# Altium schematic sheet H204_R_MCUs.SchDoc: H204 - MCUs
size A2; SheetNumber: 1; SheetTotal: 3; PageSetup: Record=PageOptions|CenterHorizontal=True|CenterVertical=True|PrintScale=0.63|XCorrection=1.00|YCorrection=1.00|PrintKind=0|BorderSize=5000000|LeftOffset=0|BottomOffset=0|Orientation=2|PaperLength=2794|PaperWidth=4318|Scale=100|PaperSource=7|PrintQuality=600|MediaType=1|DitherType=10|PaperKind=Legal (8 ½ x 14 in)|PrintScaleMode=1
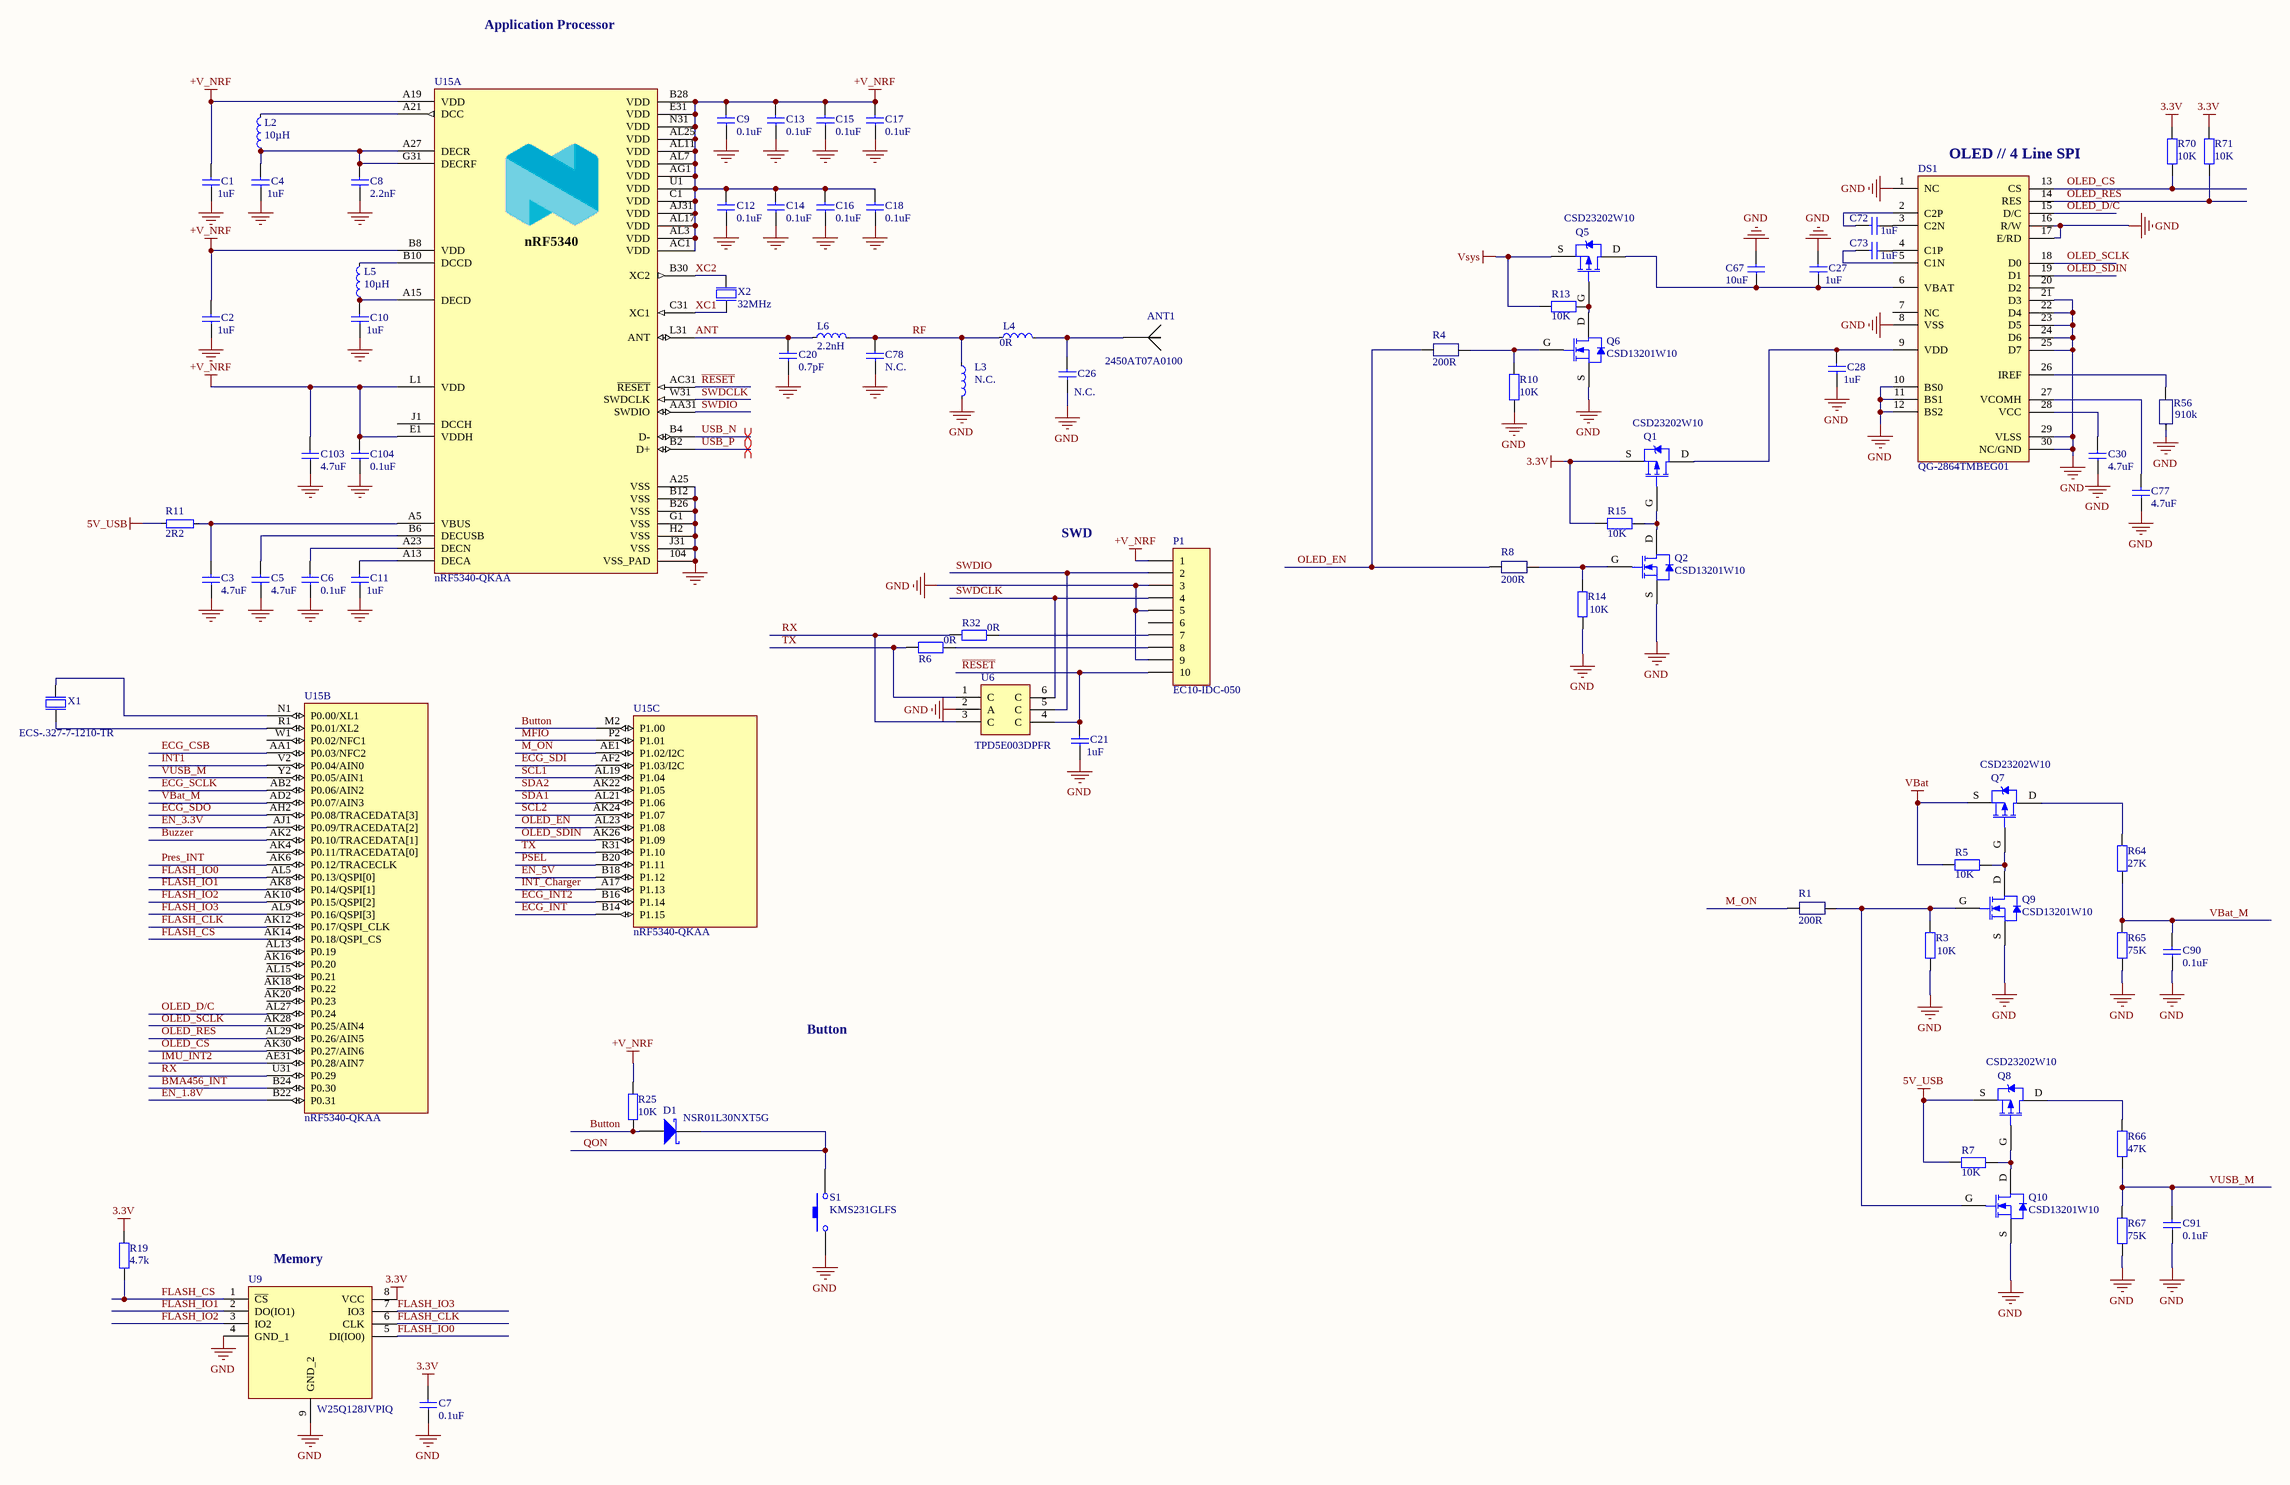
[diagram p0: H204_R_MCUs.SchDoc]

## Parts
ANT1  2450AT07A0100  [2450AT07A0100]
C1  1uF  [CAPC0603X33N]
C2  1uF  [CAPC0603X33N]
C3  4.7uF  [CAPC1005X55N]
C4  1uF  [CAPC0603X33N]
C5  4.7uF  [CAPC1005X55N]
C6  0.1uF  [CAPC0603X33N]
C7  0.1uF  [CAPC0603X33N]
C8  2.2nF  [CAPC0603X33N]
C9  0.1uF  [CAPC0603X33N]
C10  1uF  [CAPC0603X33N]
C11  1uF  [CAPC0603X33N]
C12  0.1uF  [CAPC0603X33N]
C13  0.1uF  [CAPC0603X33N]
C14  0.1uF  [CAPC0603X33N]
C15  0.1uF  [CAPC0603X33N]
C16  0.1uF  [CAPC0603X33N]
C17  0.1uF  [CAPC0603X33N]
C18  0.1uF  [CAPC0603X33N]
C20  0.7pF  [CAPC0603X33N]
C21  1uF  [CAPC0603X33N]
C26  N.C.  [CAPC0603X33N]
C27  1uF  [CAPC0603X33N]
C28  1uF  [CAPC0603X33N]
C30  4.7uF  [CAPC1005X55N]
C67  10uF  [CAPC1005X55N]
C72  1uF  [CAPC0603X33N]
C73  1uF  [CAPC0603X33N]
C77  4.7uF  [CAPC1005X55N]
C78  N.C.  [CAPC0603X33N]
C90  0.1uF  [CAPC0603X33N]
C91  0.1uF  [CAPC0603X33N]
C103  4.7uF  [CAPC1005X55N]
C104  0.1uF  [CAPC0603X33N]
D1  NSR01L30NXT5G  [NSR01L30NXT5G]
DS1  QG-2864TMBEG01  [QG-2864TMBEG01]
L2  10µH  [INDC1608X100N]
L3  N.C.  [INDC0603X33N]
L4  0R  [INDC0603X33N]
L5  10µH  [INDC1608X100N]
L6  2.2nH  [INDC0603X33N]
P1  EC10-IDC-050  [EC10-IDC-050]
Q1  CSD23202W10  [4-UFBGA]
Q2  CSD13201W10  [CSD13201W10]
Q5  CSD23202W10  [4-UFBGA]
Q6  CSD13201W10  [CSD13201W10]
Q7  CSD23202W10  [4-UFBGA]
Q8  CSD23202W10  [4-UFBGA]
Q9  CSD13201W10  [CSD13201W10]
Q10  CSD13201W10  [CSD13201W10]
R1  200R  [RESC0603X26N]
R3  10k  [RESC0603X26N]
R4  200R  [RESC0603X26N]
R5  10k  [RESC0603X26N]
R6  0R  [RESC0603X26N]
R7  10k  [RESC0603X26N]
R8  200R  [RESC0603X26N]
R10  10k  [RESC0603X26N]
R11  2R2  [RESC0603X26N]
R13  10k  [RESC0603X26N]
R14  10k  [RESC0603X26N]
R15  10k  [RESC0603X26N]
R19  4.7k  [RESC0603X26N]
R25  10k  [RESC0603X26N]
R32  0R  [RESC0603X26N]
R56  910k  [RESC0603X26N]
R64  27k  [RESC0603X26N]
R65  75k  [RESC0603X26N]
R66  47k  [RESC0603X26N]
R67  75k  [RESC0603X26N]
R70  10k  [RESC0603X26N]
R71  10k  [RESC0603X26N]
S1  KMS231GLFS  [KMS231GLFS]
U6  TPD5E003DPFR  [SON35P100X100X40-6N]
U9  W25Q128JVPIQ  [SON127P500X600X80-9N]
U15  nRF5340-QKAA  [AQFN40P700X700X85_HS-99N]  (parts A,B,C of 3)
X1  ECS-.327-7-1210-TR  [XTAL_ECS-.327-7-1210-TR]
X2  32MHz  [OSC_XRCTD37M400FXQ50R0]

## Nets
3.3V: C7.1 Q1.S R15.2 R19.1 R70.1 R71.1 U9.8(VCC)
5V_USB: Q8.S R7.2 R11.1
+V_NRF: C1.1 C2.1 C9.1 C12.1 C13.1 C14.1 C15.1 C16.1 C17.1 C18.1 C103.1 C104.1 P1.1 R25.1 U15.A19(VDD) U15.AC1(VDD) U15.AG1(VDD) U15.AJ31(VDD) U15.AL3(VDD) U15.AL7(VDD) U15.AL11(VDD) U15.AL17(VDD) U15.AL25(VDD) U15.B8(VDD) U15.B28(VDD) U15.C1(VDD) U15.E1(VDDH) U15.E31(VDD) U15.L1(VDD) U15.N31(VDD) U15.U1(VDD)
GND: ANT1.2 C1.2 C2.2 C3.2 C4.2 C5.2 C6.2 C7.2 C8.2 C9.2 C10.2 C11.2 C12.2 C13.2 C14.2 C15.2 C16.2 C17.2 C18.2 C20.1 C21.2 C26.1 C27.1 C28.2 C30.2 C67.1 C77.2 C78.1 C90.2 C91.2 C103.2 C104.2 DS1.1(NC) DS1.8(VSS) DS1.10(BS0) DS1.11(BS1) DS1.12(BS2) DS1.16(R/W) DS1.17(E/RD) DS1.21(D3) DS1.22(D4) DS1.23(D5) DS1.24(D6) DS1.25(D7) DS1.29(VLSS) DS1.30(NC/GND) L3.2 P1.3 P1.5 P1.9 Q2.S Q6.S Q9.S Q10.S R3.1 R10.1 R14.1 R56.1 R65.2 R67.2 S1.1 U6.2(A) U9.4(GND_1) U9.9(GND_2) U15.104(VSS_PAD) U15.A25(VSS) U15.B12(VSS) U15.B26(VSS) U15.G1(VSS) U15.H2(VSS) U15.J31(VSS) X2.2(GND) X2.4(GND)
VBat: Q7.S R5.2
Vsys: Q5.S R13.2
ANT: C20.2 L6.2 U15.L31(ANT)
BMA456_INT: U15.B24(P0.30)
Button: D1.1(A) R25.2 U15.M2(P1.00)
Buzzer: U15.AK2(P0.10/TRACEDATA[1])
ECG_CSB: U15.AA1(P0.03/NFC2)
ECG_INT: U15.B14(P1.15)
ECG_INT2: U15.B16(P1.14)
ECG_SCLK: U15.AB2(P0.06/AIN2)
ECG_SDI: U15.AF2(P1.03/I2C)
ECG_SDO: U15.AH2(P0.08/TRACEDATA[3])
EN_1.8V: U15.B22(P0.31)
EN_3.3V: U15.AJ1(P0.09/TRACEDATA[2])
EN_5V: U15.B18(P1.12)
FLASH_CLK: U9.6(CLK) U15.AK12(P0.17/QSPI_CLK)
FLASH_CS: R19.2 U9.1(~{CS}) U15.AK14(P0.18/QSPI_CS)
FLASH_IO0: U9.5(DI(IO0)) U15.AL5(P0.13/QSPI[0])
FLASH_IO1: U9.2(DO(IO1)) U15.AK8(P0.14/QSPI[1])
FLASH_IO2: U9.3(IO2) U15.AK10(P0.15/QSPI[2])
FLASH_IO3: U9.7(IO3) U15.AL9(P0.16/QSPI[3])
IMU_INT2: U15.AE31(P0.28/AIN7)
INT1: U15.V2(P0.04/AIN0)
INT_Charger: U15.A17(P1.13)
M_ON: R1.1 U15.AE1(P1.02/I2C)
MFIO: U15.P2(P1.01)
OLED_CS: DS1.13(CS) R70.2 U15.AK30(P0.27/AIN6)
OLED_D/C: DS1.15(D/C) U15.AL27(P0.24)
OLED_EN: R4.1 R8.1 U15.AL23(P1.08)
OLED_RES: DS1.14(RES) R71.2 U15.AL29(P0.26/AIN5)
OLED_SCLK: DS1.18(D0) U15.AK28(P0.25/AIN4)
OLED_SDIN: DS1.19(D1) U15.AK26(P1.09)
Pres_INT: U15.AK6(P0.12/TRACECLK)
PSEL: U15.B20(P1.11)
QON: D1.2(K) S1.2
~{RESET}: C21.1 P1.10 U6.4(C) U15.AC31(~{RESET})
RF: C78.2 L3.1 L4.1 L6.1
RX: R32.1 U6.3(C) U15.U31(P0.29)
SCL1: U15.AL19(P1.04)
SCL2: U15.AK24(P1.07)
SDA1: U15.AL21(P1.06)
SDA2: U15.AK22(P1.05)
SWDCLK: P1.4 U6.6(C) U15.W31(SWDCLK)
SWDIO: P1.2 U6.5(C) U15.AA31(SWDIO)
TX: R6.1 U6.1(C) U15.R31(P1.10)
USB_N: U15.B4(D-)
USB_P: U15.B2(D+)
VBat_M: C90.1 R64.2 R65.1 U15.AD2(P0.07/AIN3)
VUSB_M: C91.1 R66.2 R67.1 U15.Y2(P0.05/AIN1)
XC1: U15.C31(XC1) X2.1(inp)
XC2: U15.B30(XC2) X2.3(out)
NetANT1_1: ANT1.1 C26.2 L4.2
NetC3_1: C3.1 R11.2 U15.A5(VBUS)
NetC4_1: C4.1 C8.1 L2.1 U15.A27(DECR) U15.G31(DECRF)
NetC5_1: C5.1 U15.B6(DECUSB)
NetC6_1: C6.1 U15.A23(DECN)
NetC10_1: C10.1 L5.1 U15.A15(DECD)
NetC11_1: C11.1 U15.A13(DECA)
NetC27_2: C27.2 C67.2 DS1.6(VBAT) Q5.D
NetC28_1: C28.1 DS1.9(VDD) Q1.D
NetC30_1: C30.1 DS1.28(VCC)
NetC72_1: C72.1 DS1.3(C2N)
NetC72_2: C72.2 DS1.2(C2P)
NetC73_1: C73.1 DS1.4(C1P)
NetC73_2: C73.2 DS1.5(C1N)
NetC77_1: C77.1 DS1.27(VCOMH)
NetDS1_26: DS1.26(IREF) R56.2
NetL2_2: L2.2 U15.A21(DCC)
NetL5_2: L5.2 U15.B10(DCCD)
NetP1_7: P1.7 R32.2
NetP1_8: P1.8 R6.2
NetQ1_G: Q1.G Q2.D R15.1
NetQ2_G: Q2.G R8.2 R14.2
NetQ5_G: Q5.G Q6.D R13.1
NetQ6_G: Q6.G R4.2 R10.2
NetQ7_D: Q7.D R64.1
NetQ7_G: Q7.G Q9.D R5.1
NetQ8_D: Q8.D R66.1
NetQ8_G: Q8.G Q10.D R7.1
NetQ9_G: Q9.G Q10.G R1.2 R3.2
NetU15_N1: U15.N1(P0.00/XL1) X1.1(inp)
NetU15_R1: U15.R1(P0.01/XL2) X1.2(out)

Not connected (* = marked no-connect by the designer): DS1 7(NC) 20(D2); P1 6; U15 AG31(N.C.) AK4(P0.11/TRACEDATA[0]) AK16(P0.20) AK18(P0.22) AK20(P0.23) AL13(P0.19) AL15(P0.21) D2(N.C.) F2(N.C.) J1(DCCH) T2(N.C.) W1(P0.02/NFC1)

## Layout directives
differential pair: USB_N, USB_P

## Notes on the sheet
- Application Processor
- (near DS1) OLED // 4 Line SPI
- SWD
- Button
- (near U9) Memory
- Title
- Size:
- Date:
- File:
- A2
- Number:
- Time:
- Revision:
- Sheet
- of
- (in symbol nRF5340-QKAA, part A) nRF5340

## Library data of the parts
ANT1 = ANT: Antennas 2.4GHz CHIP ANTENNA ULTRA MINI 0.37mm; Manufacturer: Johanson; Manufacturer Part Number: 2450AT07A0100T; Impedance: 50R; Power Rating: 2W; Number of Bands: 1; Return Loss: -6.5dB; Gain: -1.5dB; Supplier 1: Digi-Key; Supplier Part Number 1: 712-1572-1-ND; RoHS: No; Category: RF Antennas; Stock 1: 290006; Pricing 1: 1=0,62000, 10=0,54400, 25=0,51160, 100=0,41740, 250=0,38776, 500=0,33000, 1000=0,26400, 2500=0,24750 (USD); Mount: Surface Mount; Case/Package: 0402; Packaging: Tape and Reel; Package Quantity: 10000; Max Power Dissipation: 2W; Termination: Solder; Frequency: 2.4GHz; Series: -; Length: 1mm; Width: 0.5mm; Height: 0.015inch; RoHS Compliant: No; ComponentLink1URL: https://datasheet.ciiva.com/24073/antenna-2450at07a0100-v5-242421-24073130.pdf?src-supplier=Mouser; ComponentLink1Description: https://datasheet.ciiva.com/24073/antenna-2450at07a0100-v5-242421-24073130.pdf?src-supplier=Mouser
C1 C2 C4 C10 C11 C21 C27 C28 = C0402-1µ0: CAP CER 1UF 6.3V X5R 0201; Manufacturer: Samsung; Manufacturer Part Number: CL03A105MQ3CSNC; Tolerance: 20%; Supplier 1: Digi-Key; Supplier Part Number 1: 1276-1325-1-ND; RoHS: Yes; Category: Ceramic Capacitors; Stock 1: 10; Pricing 1: 1=0,10000, 10=0,03500, 50=0,01940, 100=0,01580, 500=0,01128, 1000=0,00886, 2500=0,00805, 5000=0,00741 (USD); Mount: Surface Mount; Case/Package: 0201; Case Code (Metric): 0603; Case Code (Imperial): 0201; Min Operating Temperature: -55°C; Max Operating Temperature: 85°C; Package Quantity: 1; Packaging: Tape and Reel; Capacitance: 1uF; Voltage Rating: 6.3V; Dielectric: X5R; Series: CL; Length: 0.024inch; Width: 0.012inch; Thickness: 0.013inch; Depth: 0.3mm; Lead Free: Lead Free; RoHS Compliant: Yes; ComponentLink1URL: https://datasheet.ciiva.com/25786/cl03a105mq3csnc-25786759.pdf?src-supplier=Digi-Key; ComponentLink1Description: https://datasheet.ciiva.com/25786/cl03a105mq3csnc-25786759.pdf?src-supplier=Digi-Key; Value: 1uF
C3 C5 C30 C77 C103 = C0603-4µ7: Cap Ceramic 4.7uF 16V X5R 20% SMD 0402 85C T/R; Manufacturer: Samsung; Manufacturer Part Number: CL05A475MO5NUNC; Value: 4.7uF; Supplier 1: Digi-Key; Supplier Part Number 1: 1276-6836-1-ND; RoHS: Yes; Category: Ceramic Capacitors; Stock 1: 298882; Pricing 1: 1=0,51000, 10=0,35100, 50=0,24600, 100=0,21090, 500=0,15814, 1000=0,13355, 2500=0,12652, 5000=0,11949 (USD); Mount: Surface Mount; Case/Package: 0402; Case Code (Metric): 1005; Case Code (Imperial): 0402; Min Operating Temperature: -55°C; Max Operating Temperature: 85°C; Packaging: Tape and Reel; Capacitance: 4.7uF; Voltage Rating: 16V; Tolerance: 20%; Length: 0.039inch; Width: 0.02inch; Thickness: 0.022inch; RoHS Compliant: Yes; ComponentLink1URL: http://www.farnell.com/datasheets/2710653.pdf?src-supplier=Farnell; ComponentLink1Description: http://www.farnell.com/datasheets/2710653.pdf?src-supplier=Farnell; ComponentLink2URL: http://www.farnell.com/datasheets/2710653.pdf?src-supplier=Newark; ComponentLink2Description: http://www.farnell.com/datasheets/2710653.pdf?src-supplier=Newark; ComponentLink3URL: http://www.samsungsem.com/kr/support/product-search/mlcc/CL05A475MO5NUNC.jsp?src-supplier=Digi-Key; ComponentLink3Description: http://www.samsungsem.com/kr/support/product-search/mlcc/CL05A475MO5NUNC.jsp?src-supplier=Digi-Key
C6 C7 C9 C12-C18 C90 C91 C104 = C0201-100n: CAP CER 0.1UF 16V X5R 0201; Manufacturer: Samsung; Manufacturer Part Number: CL03A104KO3NNNC; Capacitance: 100nF; Tolerance: 10%; Value: 0.1uF; Supplier 1: Digi-Key; Supplier Part Number 1: 1276-1319-1-ND; RoHS: Yes; Category: Ceramic Capacitors; Stock 1: 1005663; Pricing 1: 1=0,12000, 10=0,08500, 50=0,04640, 100=0,03790, 500=0,02704, 1000=0,02125, 2500=0,01932, 5000=0,01777 (USD); Mount: Surface Mount; Case/Package: 0201; Case Code (Metric): 0603; Case Code (Imperial): 0201; Contact Plating: Tin; Min Operating Temperature: -55°C; Max Operating Temperature: 85°C; Package Quantity: 1; Packaging: Tape and Reel; Voltage Rating: 16V; Dielectric: X5R; Voltage Rating (DC): 16V; Series: CL; Construction: Flat; Length: 0.6mm; Width: 0.012inch; Height: 0.3mm; Thickness: 0.013inch; Depth: 0.3mm; Radiation Hardening: No; RoHS Compliant: Yes; ComponentLink1URL: https://datasheet.ciiva.com/25794/cl03a104ko3nnnc-25794320.pdf?src-supplier=Digi-Key; ComponentLink1Description: https://datasheet.ciiva.com/25794/cl03a104ko3nnnc-25794320.pdf?src-supplier=Digi-Key; ComponentLink2URL: https://datasheet.ciiva.com/26838/getdatasheetpartid-359638-26838082.pdf?src-supplier=Verical; ComponentLink2Description: https://datasheet.ciiva.com/26838/getdatasheetpartid-359638-26838082.pdf?src-supplier=Verical
C8 = C0201-2n2: CAP CER 2200PF 10V X7R 0201; Manufacturer: Samsung; Manufacturer Part Number: CL03B222KP3NNNC; Tolerance: 10%; Value: 2.2nF; Supplier 1: Digi-Key; Supplier Part Number 1: 1276-1349-1-ND; RoHS: Yes; Category: Ceramic Capacitors; Stock 1: 135845; Pricing 1: 1=0,11000, 10=0,07600, 50=0,04340, 100=0,03590, 500=0,02516, 1000=0,02083, 2500=0,01939, 5000=0,01774 (USD); Mount: Surface Mount; Case/Package: 0201; Case Code (Metric): 0603; Case Code (Imperial): 0201; Min Operating Temperature: -55°C; Max Operating Temperature: 125°C; Capacitance: 2.2nF; Dielectric: X7R; Package Quantity: 1; Packaging: Tape and Reel; Voltage Rating: 10V; Voltage Rating (DC): 10V; Series: CL; Construction: Flat; Length: 0.6mm; Width: 0.012inch; Height: 0.3mm; Thickness: 0.013inch; Depth: 0.3mm; Radiation Hardening: No; Lead Free: Lead Free; RoHS Compliant: Yes; ComponentLink1URL: https://datasheet.ciiva.com/25804/cl03b222kp3nnnc-25804544.pdf?src-supplier=Digi-Key; ComponentLink1Description: https://datasheet.ciiva.com/25804/cl03b222kp3nnnc-25804544.pdf?src-supplier=Digi-Key
C20 = C0201-0.7p: Multilayer Ceramic Capacitors MLCC - SMD/SMT 0201 0.7pF 25volts C0G +/-0.1pF; Manufacturer: Murata; Manufacturer Part Number: GRM0335C1ER70BA01D; Pad Count: 2; Voltage Rating: 25V; Part Number: C0201-0.7p; Value: 0.7pF; Footprint Doc: 0201; Component Class: Capacitors; Supplier 1: Digi-Key; Supplier Part Number 1: 490-11307-1-ND; RoHS: Yes; Category: Ceramic Capacitors; Stock 1: 47212; Pricing 1: 1=0,10000, 10=0,02000, 50=0,01100, 100=0,00900, 500=0,00644, 1000=0,00506, 2500=0,00460, 5000=0,00423 (USD); Mount: Surface Mount; Case/Package: 0201; Case Code (Imperial): 0201; Case Code (Metric): 0603; Min Operating Temperature: -55°C; Max Operating Temperature: 125°C; Capacitance: 0.7pF; Voltage Rating (DC): 25V; Packaging: Tape and Reel; Package Quantity: 15000; Dielectric: C0G; Termination: SMD/SMT; Series: GRM; Length: 0.024inch; Width: 0.012inch; Height: 0.3mm; Thickness: 0.013inch; RoHS Compliant: Yes; ComponentLink1URL: https://datasheet.ciiva.com/29538/partnumbering-e-01-29538603.pdf?src-supplier=Digi-Key; ComponentLink1Description: https://datasheet.ciiva.com/29538/partnumbering-e-01-29538603.pdf?src-supplier=Digi-Key
C26 = C0402-1.5p: Capacitor, NP0, ±0.1pF; Value: N.C.
C67 = C0603-4µ7: CAP CER 10UF 10V X5R 0402; Manufacturer: Samsung; Manufacturer Part Number: CL05A106MP8NUB8; Tolerance: 20%; Value: 10uF; Supplier 1: Digi-Key; Supplier Part Number 1: 1276-6830-2-ND; RoHS: Yes; Category: Ceramic Capacitors; Stock 1: 5635891; Pricing 1: 8000=0,08247 (USD); Mount: Surface Mount; Case/Package: 0402; Case Code (Metric): 1005; Case Code (Imperial): 0402; Min Operating Temperature: -55°C; Max Operating Temperature: 85°C; Packaging: Tape and Reel; Capacitance: 10uF; Voltage Rating: 10V; Length: 0.039inch; Width: 0.02inch; Thickness: 0.035inch; RoHS Compliant: Yes; ComponentLink1URL: http://www.samsungsem.com/kr/support/product-search/mlcc/CL05A106MP8NUB8.jsp?src-supplier=Digi-Key; ComponentLink1Description: http://www.samsungsem.com/kr/support/product-search/mlcc/CL05A106MP8NUB8.jsp?src-supplier=Digi-Key
C72 C73 = C0603-1µ0: Cap Ceramic 1uF 16V X5R 20% Pad SMD 0201 85C T/R; Manufacturer: Samsung; Manufacturer Part Number: CL03A105MO3NRNH; Value: 1uF; Supplier 1: Digi-Key; Supplier Part Number 1: 1276-6798-1-ND; RoHS: Yes; Category: Ceramic Capacitors; Stock 1: 1363872; Pricing 1: 1=0,28000, 10=0,19300, 50=0,11600, 100=0,09790, 500=0,06698, 1000=0,05925, 2500=0,05667, 5000=0,05152 (USD); Mount: Surface Mount; Case/Package: 0201; Case Code (Metric): 0603; Case Code (Imperial): 0201; Min Operating Temperature: -55°C; Max Operating Temperature: 85°C; Packaging: Tape and Reel; Capacitance: 1uF; Voltage Rating: 16V; Tolerance: 20%; Length: 0.024inch; Width: 0.012inch; Thickness: 0.013inch; RoHS Compliant: Yes; ComponentLink1URL: http://www.samsungsem.com/kr/support/product-search/mlcc/CL03A105MO3NRNH.jsp?src-supplier=Digi-Key; ComponentLink1Description: http://www.samsungsem.com/kr/support/product-search/mlcc/CL03A105MO3NRNH.jsp?src-supplier=Digi-Key
C78 = C0201-N.C.: Not mounted; Value: N.C.
D1 = Schottky: ON SEMICONDUCTOR - NSR01L30NXT5G - Small Signal Schottky Diode, Single, 30 V, 100 mA, 530 mV, 4 A, 150 °C; Forward Voltage: 530mV; Forward Current: 100mA; Max Repetitive Reverse Voltage (Vrrm): 30V; Max Forward Surge Current (Ifsm): 4A; Max Reverse Current: 3uA; Supplier 1: Digi-Key; Supplier Part Number 1: NSR01L30NXT5GOSCT-ND; Manufacturer: ON Semiconductor; Manufacturer Part Number: NSR01L30NXT5G; RoHS: Yes; Category: Schottky Diodes; Stock 1: 38186; Pricing 1: 1=0,43000, 10=0,32300, 100=0,20140, 500=0,13780, 1000=0,10600, 2000=0,09540 (USD); Case/Package: 0201; Number of Pins: 2; Max Operating Temperature: 150°C; Package Quantity: 5000; Packaging: Tape and Reel; Series: -; Average Rectified Current: 100mA; Peak Non-Repetitive Surge Current: 4A; Element Configuration: Single; Max Reverse Voltage (DC): 30V; Radiation Hardening: No; RoHS Compliant: Yes; REACH SVHC: No SVHC; Lead Free: Lead Free; ComponentLink1URL: https://datasheet.ciiva.com/4714/nsr01l30-d-118977-4714835.pdf?src-supplier=Mouser; ComponentLink1Description: https://datasheet.ciiva.com/4714/nsr01l30-d-118977-4714835.pdf?src-supplier=Mouser; ComponentLink2URL: https://datasheet.ciiva.com/22659/nsr01l30-d-22659110.pdf?src-supplier=Element14; ComponentLink2Description: https://datasheet.ciiva.com/22659/nsr01l30-d-22659110.pdf?src-supplier=Element14; ComponentLink3URL: https://datasheet.ciiva.com/8293/nsr01l30-d-8293831.pdf?src-supplier=Avnet; ComponentLink3Description: https://datasheet.ciiva.com/8293/nsr01l30-d-8293831.pdf?src-supplier=Avnet; ComponentLink4URL: https://datasheet.ciiva.com/6381/nsr01l30-d-6381900.pdf?src-supplier=Digi-Key; ComponentLink4Description: https://datasheet.ciiva.com/6381/nsr01l30-d-6381900.pdf?src-supplier=Digi-Key
DS1 = OLED: Header, 20-Pin
L2 L5 = L0603-10µ: FIXED IND 10UH 380MA 468 MOHM; Manufacturer: Taiyo Yuden; Manufacturer Part Number: CBMF1608T100M; Pad Count: 2; Core Material: Ferrite; Tolerance: 20%; Self Resonant Frequency: 32MHz; Max DC Current: 115mA; DC Resistance (DCR): 468mR; Test Frequency: 2.52MHz; Part Number: L0603-10µ; Value: 10µH; Footprint Doc: 0603; Component Class: Inductors; Supplier 1: Digi-Key; Supplier Part Number 1: 587-5830-1-ND; RoHS: Yes; Category: Fixed Inductors; Stock 1: 26531; Pricing 1: 1=0,26000, 10=0,22900, 25=0,20000, 50=0,17160, 100=0,15730, 250=0,14300, 500=0,13442, 1000=0,10296 (USD); Case/Package: 0603; Min Operating Temperature: -40°C; Max Operating Temperature: 105°C; Inductance: 10uH; Packaging: Tape and Reel; DC Current: 380mA; Length: 1.8mm; Height: 0.8mm; Depth: 1mm; Radiation Hardening: No; Military Standard: Not; Lead Free: Lead Free; Halogen Free: Halogen Free; RoHS Compliant: Yes; ComponentLink1URL: https://datasheet.ciiva.com/25607/0900766b810b3b0a-25607920.pdf?src-supplier=RSComponents; ComponentLink1Description: https://datasheet.ciiva.com/25607/0900766b810b3b0a-25607920.pdf?src-supplier=RSComponents; ComponentLink2URL: https://datasheet.ciiva.com/26871/getdatasheetpartid-638767-26871193.pdf?src-supplier=Verical; ComponentLink2Description: https://datasheet.ciiva.com/26871/getdatasheetpartid-638767-26871193.pdf?src-supplier=Verical
L3 = L0402-3n3: Inductor, 190mA, ±0.1nH; Value: N.C.
L4 = L0402-3n3: Fixed Resistor, Metal Glaze/thick Film, 0.05W, 0ohm, Surface Mount, 0201; Manufacturer: Yageo; Manufacturer Part Number: AF0201JR-070RL; Resistance: 0mR; Max Power Dissipation: 50mW; Value: 0R; Supplier 1: Digi-Key; Supplier Part Number 1: 13-AF0201JR-070RLCT-ND; RoHS: Yes; Category: Chip SMD Resistors; Stock 1: 9; Pricing 1: 1=0,11000, 10=0,09500, 25=0,06560, 50=0,05100, 100=0,03640, 250=0,02840, 500=0,02256, 1000=0,01602, 5000=0,01238 (USD); Case/Package: 0201; Case Code (Imperial): 0201; Case Code (Metric): 0603; Weight: 6E-06oz; Min Operating Temperature: -55°C; Max Operating Temperature: 125°C; Packaging: Tape and Reel; Resistor Type: Thick Film; Number of Terminations: 2; Package Quantity: 10000; Termination: SMD/SMT; Features: Moisture Resistant,Anti-Sulfur; Length: 0.024inch; Width: 0.012inch; Height: 0.01inch; RoHS Compliant: Yes; ComponentLink1URL: http://www.mouser.com/ds/2/447/PYu-AF_51_RoHS_L_5-1085711.pdf?src-supplier=Mouser; ComponentLink1Description: http://www.mouser.com/ds/2/447/PYu-AF_51_RoHS_L_5-1085711.pdf?src-supplier=Mouser; ComponentLink2URL: http://www.yageo.com/documents/recent/PYu-AF_51_RoHS_L_5.pdf?src-supplier=Digi-Key; ComponentLink2Description: http://www.yageo.com/documents/recent/PYu-AF_51_RoHS_L_5.pdf?src-supplier=Digi-Key
L6 = L0201-2n2: FIXED IND 2.2NH 600MA 150 MOHM; Manufacturer: Murata; Manufacturer Part Number: LQP03TN2N2B02D; Pad Count: 2; Core Material: Non-Magnetic; DC Resistance (DCR): 150mR; Shielding: Unshielded; Self Resonant Frequency: 11GHz; Test Frequency: 500MHz; Current: 400mA; Q Factor: 14; Part Number: L0201-2n2; Footprint Doc: 0201; Value: 2.2nH; Component Class: Inductors; Supplier 1: Digi-Key; Supplier Part Number 1: 490-6723-1-ND; RoHS: Yes; Category: Fixed Inductors; Stock 1: 114542; Pricing 1: 1=0,10000, 10=0,04700, 25=0,04240, 50=0,03780, 100=0,03210, 250=0,02836, 500=0,02598, 1000=0,02221, 2500=0,01984 (USD); Mount: Surface Mount; Case/Package: 0201; Case Code (Metric): 0603; Case Code (Imperial): 0201; Min Operating Temperature: -55°C; Max Operating Temperature: 125°C; Inductance: 2.2nH; Max DC Current: 600mA; Packaging: Tape and Reel; Package Quantity: 1; Current Rating: 600mA; Resistor Type: Thin Film; Termination: SMD/SMT; DC Current: 600mA; Series: LQP; Technology: THIN FILM; Length: 0.6mm; Width: 0.012inch; Height: 0.3mm; Height - Seated (Max): 0.013inch; Depth: 0.33mm; Radiation Hardening: No; Military Standard: Not; REACH SVHC: No SVHC; Lead Free: Lead Free; RoHS Compliant: Yes; ComponentLink1URL: https://datasheet.ciiva.com/4975/product-4975942.pdf?src-supplier=Mouser; ComponentLink1Description: https://datasheet.ciiva.com/4975/product-4975942.pdf?src-supplier=Mouser
P1 = Header 10: Header, 10-Pin
Q1 Q5 Q7 Q8 = Transistor P-channel: -12V, P ch NexFET MOSFET™, single WLP 1.0x1.0, 53mOhm 4-DSBGA; Manufacturer: Texas Instruments; Drain to Source Voltage (Vdss): 12V; Continuous Drain Current (ID): 2.2A; Rds On Max: 53mR; Input Capacitance: 512pF; Max Power Dissipation: 1W; Gate to Source Voltage (Vgs): 6V; Number of Channels: 1; Drain to Source Resistance: 44mR; Fall Time: 21ns; Rise Time: 4ns; Turn-Off Delay Time: 58ns; Turn-On Delay Time: 9ns; Supplier 1: Digi-Key; Supplier Part Number 1: 296-40000-1-ND; Manufacturer Part Number: CSD23202W10; RoHS: Yes; Category: Integrated Circuits (ICs); Stock 1: 87297; Pricing 1: 1=0,43000, 10=0,37100, 100=0,27720, 500=0,21780, 1000=0,16830 (USD); Mount: Surface Mount; Number of Pins: 4; Min Operating Temperature: -55°C; Max Operating Temperature: 150°C; Packaging: Tape and Reel; Drain to Source Breakdown Voltage: -12V; Package Quantity: 3000; Element Configuration: Single; Number of Elements: 1; Power Dissipation: 1W; Lead Free: Lead Free; RoHS Compliant: Yes; ComponentLink1URL: http://components.arrow.com/part/dataview/69249902S1040162N7713?src-supplier=Arrow+Electronics; ComponentLink1Description: http://components.arrow.com/part/dataview/69249902S1040162N7713?src-supplier=Arrow+Electronics; ComponentLink2URL: http://www.ti.com/lit/gpn/csd23202w10?src-supplier=Mouser; ComponentLink2Description: http://www.ti.com/lit/gpn/csd23202w10?src-supplier=Mouser; ComponentLink3URL: http://www.ti.com/lit/ds/symlink/csd23202w10.pdf?src-supplier=Digi-Key; ComponentLink3Description: http://www.ti.com/lit/ds/symlink/csd23202w10.pdf?src-supplier=Digi-Key; ComponentLink4URL: http://www.ti.com/general/docs/lit/getliterature.tsp?genericPartNumber=CSD23202W10&&fileType=pdf&src-supplier=Avnet; ComponentLink4Description: http://www.ti.com/general/docs/lit/getliterature.tsp?genericPartNumber=CSD23202W10&&fileType=pdf&src-supplier=Avnet
Q2 Q6 Q9 Q10 = Transistor N-channel: 12V, N ch NexFET MOSFET™, single WLP 1.0x1.0, 34mOhm 4-DSBGA -55 to 150; Manufacturer: Texas Instruments; Rds On Max: 34mR; Input Capacitance: 462pF; Continuous Drain Current (ID): 1.6A; Max Power Dissipation: 1.2W; Rise Time: 5.9ns; Number of Elements: 1; Turn-On Delay Time: 3.9ns; Turn-Off Delay Time: 14.4ns; Fall Time: 9.7ns; Gate to Source Voltage (Vgs): 8V; Supplier 1: Digi-Key; Supplier Part Number 1: 296-41412-1-ND; Manufacturer Part Number: CSD13201W10; RoHS: Yes; Category: MOSFETs; Stock 1: 204100; Pricing 1: 1=0,52000, 10=0,42400, 100=0,28860, 500=0,21648, 1000=0,16236 (USD); Mount: Surface Mount; Number of Pins: 4; Contact Plating: Copper,Tin,Silver; Min Operating Temperature: -55°C; Max Operating Temperature: 150°C; Package Quantity: 3000; Packaging: Tape and Reel; Drain to Source Voltage (Vdss): 12V; Power Dissipation: 1.2W; Element Configuration: Single; Number of Channels: 1; Drain to Source Breakdown Voltage: 12V; Drain to Source Resistance: 34mR; Lead Free: Lead Free; RoHS Compliant: Yes; ComponentLink1URL: https://datasheet.ciiva.com/30021/csd13201w10-30021961.pdf?src-supplier=Avnet; ComponentLink1Description: https://datasheet.ciiva.com/30021/csd13201w10-30021961.pdf?src-supplier=Avnet
R1 R4 R8 = Resistor: RES SMD 200 OHM 1% 1/20W 0201; Manufacturer: Yageo; Manufacturer Part Number: RC0201FR-07200RL; Voltage Rating: 25V; Power Rating: 50mW; Temperature Coefficient: 200ppm/°C; Value: 200R; Supplier 1: Digi-Key; Supplier Part Number 1: YAG2495CT-ND; RoHS: Yes; Category: Chip SMD Resistors; Stock 1: 262827; Pricing 1: 1=0,10000, 10=0,04200, 100=0,01700, 1000=0,00765, 2500=0,00664, 5000=0,00548 (USD); Case/Package: 0201; Case Code (Imperial): 0201; Case Code (Metric): 0603; Size Code: 0201; Min Operating Temperature: -55°C; Max Operating Temperature: 125°C; Package Quantity: 10000; Resistance: 200R; Tolerance: 1%; Packaging: Tape and Reel; Resistor Type: Thick Film; Termination: SMD/SMT; Number of Terminations: 2; Max Power Dissipation: 50mW; Features: Moisture Resistant; Series: RC; Construction: Rectangular; Length: 0.6mm; Width: 0.3mm; Height: 0.01inch; Depth: 0.3mm; Military Standard: Not; Lead Free: Lead Free; RoHS Compliant: Yes; ComponentLink1URL: http://components.arrow.com/part/dataview/0323_03297075?src-supplier=Arrow+Europe; ComponentLink1Description: http://components.arrow.com/part/dataview/0323_03297075?src-supplier=Arrow+Europe; ComponentLink2URL: http://www.mouser.com/ds/2/447/RC0201-559633.pdf?src-supplier=Mouser; ComponentLink2Description: http://www.mouser.com/ds/2/447/RC0201-559633.pdf?src-supplier=Mouser; ComponentLink3URL: http://www.yageo.com/documents/recent/PYu-RC_Group_51_RoHS_L_9.pdf?src-supplier=Digi-Key; ComponentLink3Description: http://www.yageo.com/documents/recent/PYu-RC_Group_51_RoHS_L_9.pdf?src-supplier=Digi-Key; ComponentLink4URL: http://www.yageo.com/documents/recent/PYu-RC_Group_51_RoHS_L_10.pdf?src-supplier=Digi-Key; ComponentLink4Description: http://www.yageo.com/documents/recent/PYu-RC_Group_51_RoHS_L_10.pdf?src-supplier=Digi-Key; ComponentLink5URL: http://www.yageo.com/documents/recent/PYu-RC0201_51_RoHS_L_(8).pdf?src-supplier=Future+Electronics; ComponentLink5Description: http://www.yageo.com/documents/recent/PYu-RC0201_51_RoHS_L_(8).pdf?src-supplier=Future+Electronics
R3 R5 R7 R10 R13-R15 R25 R70 R71 = Res2: GENERAL 0201 11% REEL (7INCH); Manufacturer: Yageo; Manufacturer Part Number: RC0201FR-0710KL; Resistance: 10kR; Tolerance: 1%; Temperature Coefficient: 200ppm/°C; Power Rating: 50mW; Voltage Rating: 25V; Value: 10K; Supplier 1: Digi-Key; Supplier Part Number 1: 311-10.0KMCT-ND; RoHS: Yes; Category: Chip SMD Resistors; Stock 1: 2380407; Pricing 1: 1=0,10000, 10=0,04200, 100=0,01700, 1000=0,00765, 2500=0,00664, 5000=0,00548 (USD); Case/Package: 0201; Number of Pins: 2; Contact Plating: Tin,Matte; Case Code (Imperial): 0201; Case Code (Metric): 0603; Weight: 6E-06oz; Min Operating Temperature: -55°C; Max Operating Temperature: 125°C; Resistor Type: Thick Film; Packaging: Tape and Reel; Package Quantity: 1; Termination: SMD/SMT; Number of Terminations: 2; Max Power Dissipation: 50mW; Voltage Rating (DC): 25V; Working Voltage: 25V; Features: Moisture Resistant; Series: RC; Technology: THICK FILM; Resistance Tolerance: 1%; Construction: Rectangular; Length: 0.6mm; Width: 0.3mm; Height: 0.01inch; Depth: 0.3mm; Radiation Hardening: No; REACH SVHC: No SVHC; Military Standard: Not; Lead Free: Lead Free; RoHS Compliant: Yes; ComponentLink1URL: https://datasheet.ciiva.com/2467/pyu-r-int-thick-7-2467109.pdf?src-supplier=Digi-Key; ComponentLink1Description: https://datasheet.ciiva.com/2467/pyu-r-int-thick-7-2467109.pdf?src-supplier=Digi-Key; ComponentLink2URL: https://datasheet.ciiva.com/2467/pyu-r-int-thick-7-2467110.pdf?src-supplier=Digi-Key; ComponentLink2Description: https://datasheet.ciiva.com/2467/pyu-r-int-thick-7-2467110.pdf?src-supplier=Digi-Key; ComponentLink3URL: https://datasheet.ciiva.com/2467/pyu-r-int-thick-7-2467111.pdf?src-supplier=Digi-Key; ComponentLink3Description: https://datasheet.ciiva.com/2467/pyu-r-int-thick-7-2467111.pdf?src-supplier=Digi-Key; ComponentLink4URL: https://datasheet.ciiva.com/7660/1421516-7660807.pdf?src-supplier=Element14; ComponentLink4Description: https://datasheet.ciiva.com/7660/1421516-7660807.pdf?src-supplier=Element14; ComponentLink5URL: https://datasheet.ciiva.com/8891/pyu-rc0201-51-rohs-l-8-8891384.pdf?src-supplier=Avnet; ComponentLink5Description: https://datasheet.ciiva.com/8891/pyu-rc0201-51-rohs-l-8-8891384.pdf?src-supplier=Avnet; ComponentLink6URL: https://datasheet.ciiva.com/28405/pyu-rc0201-51-rohs-l-8-28405609.pdf?src-supplier=Avnet+Europe; ComponentLink6Description: https://datasheet.ciiva.com/28405/pyu-rc0201-51-rohs-l-8-28405609.pdf?src-supplier=Avnet+Europe; ComponentLink7URL: https://datasheet.ciiva.com/26829/getdatasheetpartid-421074-26829851.pdf?src-supplier=Verical; ComponentLink7Description: https://datasheet.ciiva.com/26829/getdatasheetpartid-421074-26829851.pdf?src-supplier=Verical; ComponentLink8URL: https://datasheet.ciiva.com/46391/1421516-46391339.pdf?src-supplier=Element14; ComponentLink8Description: https://datasheet.ciiva.com/46391/1421516-46391339.pdf?src-supplier=Element14; ComponentLink9URL: https://datasheet.ciiva.com/16855/pyu-rc0201-51-rohs-l-8-16855789.pdf?src-supplier=Avnet+Europe; ComponentLink9Description: https://datasheet.ciiva.com/16855/pyu-rc0201-51-rohs-l-8-16855789.pdf?src-supplier=Avnet+Europe
R6 R32 = Res2: Fixed Resistor, Metal Glaze/thick Film, 0.05W, 0ohm, Surface Mount, 0201; Manufacturer: Yageo; Manufacturer Part Number: AF0201JR-070RL; Resistance: 0mR; Max Power Dissipation: 50mW; Value: 0R; Supplier 1: Digi-Key; Supplier Part Number 1: 13-AF0201JR-070RLCT-ND; RoHS: Yes; Category: Chip SMD Resistors; Stock 1: 9; Pricing 1: 1=0,11000, 10=0,09500, 25=0,06560, 50=0,05100, 100=0,03640, 250=0,02840, 500=0,02256, 1000=0,01602, 5000=0,01238 (USD); Case/Package: 0201; Case Code (Imperial): 0201; Case Code (Metric): 0603; Weight: 6E-06oz; Min Operating Temperature: -55°C; Max Operating Temperature: 125°C; Packaging: Tape and Reel; Resistor Type: Thick Film; Number of Terminations: 2; Package Quantity: 10000; Termination: SMD/SMT; Features: Moisture Resistant,Anti-Sulfur; Length: 0.024inch; Width: 0.012inch; Height: 0.01inch; RoHS Compliant: Yes; ComponentLink1URL: http://www.mouser.com/ds/2/447/PYu-AF_51_RoHS_L_5-1085711.pdf?src-supplier=Mouser; ComponentLink1Description: http://www.mouser.com/ds/2/447/PYu-AF_51_RoHS_L_5-1085711.pdf?src-supplier=Mouser; ComponentLink2URL: http://www.yageo.com/documents/recent/PYu-AF_51_RoHS_L_5.pdf?src-supplier=Digi-Key; ComponentLink2Description: http://www.yageo.com/documents/recent/PYu-AF_51_RoHS_L_5.pdf?src-supplier=Digi-Key
R11 = R0201-2R2: Res Thick Film 0201 2.2 Ohm 5% 1/20W -100ppm/C to 350ppm/C Molded SMD SMD Paper T/R; Manufacturer: Yageo; Manufacturer Part Number: RC0201JR-072R2L; Resistance: 2.2R; Temperature Coefficient: 350ppm/°C; Power Rating: 50mW; Value: 2R2; ComponentLink1URL: http://www.yageo.com/NewPortal/yageodocoutput?fileName=/pdf/R-Chip/PYu-AC_51_RoHS_L_6.pdf&src-supplier=Digi-Key; ComponentLink1Description: http://www.yageo.com/NewPortal/yageodocoutput?fileName=/pdf/R-Chip/PYu-AC_51_RoHS_L_6.pdf&src-supplier=Digi-Key; Supplier 1: Digi-Key; Supplier Part Number 1: YAG2886CT-ND; RoHS: Yes; Category: Chip SMD Resistors; Stock 1: 194959; Pricing 1: 1=0,10000, 10=0,02900, 100=0,01190, 1000=0,00536, 2500=0,00466, 5000=0,00385 (USD); Case/Package: 0201; Contact Plating: Tin,Matte; Case Code (Metric): 0603; Case Code (Imperial): 0201; Size Code: 0201; Min Operating Temperature: -55°C; Max Operating Temperature: 125°C; Tolerance: 5%; Resistor Type: Thick Film; Packaging: Tape and Reel; Number of Terminations: 2; Max Power Dissipation: 50mW; Features: Moisture Resistant; Series: RC; Length: 0.024inch; Width: 0.012inch; Height: 0.01inch; Radiation Hardening: No; Lead Free: Lead Free; RoHS Compliant: Yes; ComponentLink2URL: https://datasheet.ciiva.com/16855/pyu-rc0201-51-rohs-l-8-16855387.pdf?src-supplier=Avnet+Europe; ComponentLink2Description: https://datasheet.ciiva.com/16855/pyu-rc0201-51-rohs-l-8-16855387.pdf?src-supplier=Avnet+Europe; ComponentLink3URL: https://datasheet.ciiva.com/28415/pyu-rc0201-51-rohs-l-8-28415213.pdf?src-supplier=Avnet+Europe; ComponentLink3Description: https://datasheet.ciiva.com/28415/pyu-rc0201-51-rohs-l-8-28415213.pdf?src-supplier=Avnet+Europe
R19 = Res2: GENERAL 0201 11% REEL (7INCH); Manufacturer: Yageo; Manufacturer Part Number: RC0201FR-074K7L; Resistance: 4.7kR; Tolerance: 1%; Temperature Coefficient: 200ppm/°C; Power Rating: 50mW; Voltage Rating: 25V; Value: 4.7k; Supplier 1: Digi-Key; Supplier Part Number 1: 311-4.70KMCT-ND; RoHS: Yes; Category: Chip SMD Resistors; Stock 1: 638424; Pricing 1: 1=0,10000, 10=0,04200, 100=0,01700, 1000=0,00765, 2500=0,00664, 5000=0,00548 (USD); Case/Package: 0201; Contact Plating: Tin,Matte; Case Code (Metric): 0603; Case Code (Imperial): 0201; Weight: 6E-06oz; Size Code: 0201; Min Operating Temperature: -55°C; Max Operating Temperature: 125°C; Resistor Type: Thick Film; Packaging: Tape and Reel; Package Quantity: 1; Number of Terminations: 2; Termination: SMD/SMT; Max Power Dissipation: 50mW; Features: Moisture Resistant; Series: RC; Resistance Tolerance: 1%; Construction: Rectangular; Length: 0.6mm; Width: 0.012inch; Height: 0.01inch; Depth: 0.3mm; Radiation Hardening: No; REACH SVHC: Unknown; Military Standard: Not; Lead Free: Lead Free; RoHS Compliant: Yes; ComponentLink1URL: https://datasheet.ciiva.com/2493/pyu-r-int-thick-7-2493811.pdf?src-supplier=Digi-Key; ComponentLink1Description: https://datasheet.ciiva.com/2493/pyu-r-int-thick-7-2493811.pdf?src-supplier=Digi-Key; ComponentLink2URL: https://datasheet.ciiva.com/2493/pyu-r-int-thick-7-2493812.pdf?src-supplier=Digi-Key; ComponentLink2Description: https://datasheet.ciiva.com/2493/pyu-r-int-thick-7-2493812.pdf?src-supplier=Digi-Key; ComponentLink3URL: https://datasheet.ciiva.com/2493/pyu-r-int-thick-7-2493813.pdf?src-supplier=Digi-Key; ComponentLink3Description: https://datasheet.ciiva.com/2493/pyu-r-int-thick-7-2493813.pdf?src-supplier=Digi-Key; ComponentLink4URL: https://datasheet.ciiva.com/7672/1563626-7672233.pdf?src-supplier=Element14; ComponentLink4Description: https://datasheet.ciiva.com/7672/1563626-7672233.pdf?src-supplier=Element14; ComponentLink5URL: https://datasheet.ciiva.com/28410/pyu-rc0201-51-rohs-l-8-28410061.pdf?src-supplier=Avnet+Europe; ComponentLink5Description: https://datasheet.ciiva.com/28410/pyu-rc0201-51-rohs-l-8-28410061.pdf?src-supplier=Avnet+Europe; ComponentLink6URL: https://datasheet.ciiva.com/8892/pyu-rc0201-51-rohs-l-8-8892942.pdf?src-supplier=Avnet; ComponentLink6Description: https://datasheet.ciiva.com/8892/pyu-rc0201-51-rohs-l-8-8892942.pdf?src-supplier=Avnet
R56 = Resistor: Thick Film Resistors - SMD 910K OHM 1%; Manufacturer: Yageo; Manufacturer Part Number: RC0201FR-07910KL; Resistance: 910kR; Power Rating: 50mW; Voltage Rating: 25V; Temperature Coefficient: 200ppm/°C; Value: 910k; Supplier 1: Digi-Key; Supplier Part Number 1: YAG2840CT-ND; RoHS: Yes; Category: Chip SMD Resistors; Stock 1: 16990; Pricing 1: 1=0,10000, 10=0,04200, 100=0,01700, 1000=0,00765, 2500=0,00664, 5000=0,00548 (USD); Case/Package: 0201; Case Code (Imperial): 0201; Case Code (Metric): 0603; Min Operating Temperature: -55°C; Max Operating Temperature: 125°C; Tolerance: 1%; Packaging: Tape and Reel; Resistor Type: Thick Film; Number of Terminations: 2; Termination: SMD/SMT; Max Power Dissipation: 50mW; Features: Moisture Resistant; Series: RC; Construction: Rectangular; Length: 0.6mm; Width: 0.012inch; Height: 0.01inch; Depth: 0.3mm; Military Standard: Not; RoHS Compliant: Yes; ComponentLink1URL: http://www.mouser.com/ds/2/447/RC0201-559633.pdf?src-supplier=Mouser; ComponentLink1Description: http://www.mouser.com/ds/2/447/RC0201-559633.pdf?src-supplier=Mouser; ComponentLink2URL: http://www.yageo.com.tw/exep/pages/download/literatures/PYu-R_INT-thick_7.pdf?src-supplier=Digi-Key; ComponentLink2Description: http://www.yageo.com.tw/exep/pages/download/literatures/PYu-R_INT-thick_7.pdf?src-supplier=Digi-Key; ComponentLink3URL: http://www.yageo.com/documents/recent/PYu-RC_Group_51_RoHS_L_9.pdf?src-supplier=Digi-Key; ComponentLink3Description: http://www.yageo.com/documents/recent/PYu-RC_Group_51_RoHS_L_9.pdf?src-supplier=Digi-Key; ComponentLink4URL: http://components.arrow.com/part/dataview/0323_03295085?src-supplier=Arrow+Europe; ComponentLink4Description: http://components.arrow.com/part/dataview/0323_03295085?src-supplier=Arrow+Europe
R64 = Res2: YAGEO (PHYCOMP)         RC0201FR-0727KL             SMD Chip Resistor, Thick Film, 27 kohm, 0201 [0603 Metric], 50 mW,  1%; Resistance: 27kR; Power Rating: 50mW; Voltage Rating: 25V; Temperature Coefficient: 200ppm/°C; Value: 27K; Supplier 1: Digi-Key; Supplier Part Number 1: YAG2552CT-ND; Manufacturer: Yageo; Manufacturer Part Number: RC0201FR-0727KL; RoHS: Yes; Category: Chip SMD Resistors; Stock 1: 10000; Pricing 1: 1=0,10000, 10=0,04200, 100=0,01700, 1000=0,00765, 2500=0,00664, 5000=0,00548 (USD); Case/Package: 0201; Case Code (Imperial): 0201; Case Code (Metric): 0603; Min Operating Temperature: -55°C; Max Operating Temperature: 125°C; Tolerance: 1%; Packaging: Tape and Reel; Resistor Type: Thick Film; Number of Terminations: 2; Termination: SMD/SMT; Max Power Dissipation: 50mW; Features: Moisture Resistant; Series: RC; Resistance Tolerance: 1%; Length: 0.024inch; Width: 0.012inch; Height: 0.01inch; REACH SVHC: Unknown; Lead Free: Lead Free; RoHS Compliant: Yes; ComponentLink1URL: https://datasheet.ciiva.com/22735/1563626-22735433.pdf?src-supplier=Element14; ComponentLink1Description: https://datasheet.ciiva.com/22735/1563626-22735433.pdf?src-supplier=Element14
R65 R67 = Res2: Res Thick Film 0201 75K Ohm 1% 0.05W(1/20W) ±200ppm/C Molded SMD Paper T/R; Manufacturer: Yageo; Manufacturer Part Number: RC0201FR-0775KL; Resistance: 75kR; Max Power Dissipation: 50mW; Temperature Coefficient: 200ppm/°C; Value: 75K; Supplier 1: Digi-Key; Supplier Part Number 1: YAG2795CT-ND; RoHS: Yes; Category: Chip SMD Resistors; Stock 1: 24524; Pricing 1: 1=0,10000, 10=0,04200, 100=0,01700, 1000=0,00765, 2500=0,00664, 5000=0,00548 (USD); Case/Package: 0201; Case Code (Metric): 0603; Case Code (Imperial): 0201; Min Operating Temperature: -55°C; Max Operating Temperature: 125°C; Tolerance: 1%; Packaging: Tape and Reel; Resistor Type: Thick Film; Number of Terminations: 2; Features: Moisture Resistant; Length: 0.024inch; Width: 0.012inch; Height: 0.01inch; Depth: 0.3mm; Military Standard: Not; RoHS Compliant: Yes; ComponentLink1URL: http://components.arrow.com/part/dataview/0323_03291865?src-supplier=Arrow+Europe; ComponentLink1Description: http://components.arrow.com/part/dataview/0323_03291865?src-supplier=Arrow+Europe; ComponentLink2URL: http://www.yageo.com/documents/recent/PYu-RC_Group_51_RoHS_L_10.pdf?src-supplier=Digi-Key; ComponentLink2Description: http://www.yageo.com/documents/recent/PYu-RC_Group_51_RoHS_L_10.pdf?src-supplier=Digi-Key; ComponentLink3URL: http://www.yageo.com/documents/recent/PYu-RC_Group_51_RoHS_L_9.pdf?src-supplier=Digi-Key; ComponentLink3Description: http://www.yageo.com/documents/recent/PYu-RC_Group_51_RoHS_L_9.pdf?src-supplier=Digi-Key
R66 = Res2: GENERAL 0201 11% REEL (7INCH); Manufacturer: Yageo; Manufacturer Part Number: RC0201FR-0747KL; Temperature Coefficient: 200ppm/°C; Resistance: 47kR; Tolerance: 1%; Power Rating: 50mW; Voltage Rating: 25V; Value: 47K; Supplier 1: Digi-Key; Supplier Part Number 1: 311-47KMCT-ND; RoHS: Yes; Category: Chip SMD Resistors; Stock 1: 402963; Pricing 1: 1=0,10000, 10=0,04200, 100=0,01700, 1000=0,00765, 2500=0,00664, 5000=0,00548 (USD); Case/Package: 0201; Contact Plating: Tin,Matte; Weight: 6E-06oz; Case Code (Metric): 0603; Case Code (Imperial): 0201; Min Operating Temperature: -55°C; Max Operating Temperature: 125°C; Resistor Type: Thick Film; Number of Terminations: 2; Termination: SMD/SMT; Features: Moisture Resistant; Packaging: Tape and Reel; Package Quantity: 1; Max Power Dissipation: 50mW; Length: 0.6mm; Width: 0.012inch; Height: 0.01inch; Depth: 0.3mm; Radiation Hardening: No; Military Standard: Not; Lead Free: Lead Free; REACH SVHC: Unknown; ComponentLink1URL: https://datasheet.ciiva.com/28399/pyu-rc0201-51-rohs-l-8-28399335.pdf?src-supplier=Avnet+Europe; ComponentLink1Description: https://datasheet.ciiva.com/28399/pyu-rc0201-51-rohs-l-8-28399335.pdf?src-supplier=Avnet+Europe; ComponentLink2URL: https://datasheet.ciiva.com/29710/pyu-r-int-thick-7-29710919.pdf?src-supplier=Digi-Key; ComponentLink2Description: https://datasheet.ciiva.com/29710/pyu-r-int-thick-7-29710919.pdf?src-supplier=Digi-Key; ComponentLink3URL: https://datasheet.ciiva.com/7672/1563626-7672232.pdf?src-supplier=Element14; ComponentLink3Description: https://datasheet.ciiva.com/7672/1563626-7672232.pdf?src-supplier=Element14; ComponentLink4URL: https://datasheet.ciiva.com/29710/pyu-r-int-thick-7-29710920.pdf?src-supplier=Digi-Key; ComponentLink4Description: https://datasheet.ciiva.com/29710/pyu-r-int-thick-7-29710920.pdf?src-supplier=Digi-Key; ComponentLink5URL: https://datasheet.ciiva.com/8889/pyu-rc0201-51-rohs-l-8-8889065.pdf?src-supplier=Avnet; ComponentLink5Description: https://datasheet.ciiva.com/8889/pyu-rc0201-51-rohs-l-8-8889065.pdf?src-supplier=Avnet; ComponentLink6URL: https://datasheet.ciiva.com/26829/getdatasheetpartid-422496-26829867.pdf?src-supplier=Verical; ComponentLink6Description: https://datasheet.ciiva.com/26829/getdatasheetpartid-422496-26829867.pdf?src-supplier=Verical; ComponentLink7URL: https://datasheet.ciiva.com/16855/pyu-rc0201-51-rohs-l-8-16855917.pdf?src-supplier=Avnet+Europe; ComponentLink7Description: https://datasheet.ciiva.com/16855/pyu-rc0201-51-rohs-l-8-16855917.pdf?src-supplier=Avnet+Europe; ComponentLink8URL: https://datasheet.ciiva.com/25647/pyu-r-int-thick-7-25647310.pdf?src-supplier=Digi-Key; ComponentLink8Description: https://datasheet.ciiva.com/25647/pyu-r-int-thick-7-25647310.pdf?src-supplier=Digi-Key
S1 = SW-PB: Switch Tactile N.O. SPST Rectangular Button Gull Wing 0.05A 32VDC 1VA 100000Cycles 3N SMD T/R; Manufacturer: ITT C&K; Current Rating: 50mA; Insulation Resistance: 1GR; Contact Resistance: 100mR; Voltage Rating (DC): 32V; Power Rating: 1W; Illumination Type: Non-Illuminated,Illuminated; Direction: RIGHT; Switch Travel: 0.3mm; Switch Function: Off-Mom; Actuator Type: PLUNGER; Actuator Length: 0.75mm; Ratings: IP40; Supplier 1: Digi-Key; Supplier Part Number 1: 401-1266-1-ND; Manufacturer Part Number: KMS231GLFS; RoHS: Yes; Category: Tactile Switches; Pricing 1: 1=0,49000, 10=0,47400, 25=0,45640, 100=0,39480, 250=0,35972, 500=0,33342, 1000=0,29832 (USD); Mount: Surface Mount; Contact Material: Silver; Contact Plating: Silver; Mechanical Life: 100000Cycles; Min Operating Temperature: -40°C; Max Operating Temperature: 85°C; Packaging: Tape and Reel; Package Quantity: 3000; Termination: Gull Wing; Orientation: Right Angle; Series: KMS; Throw Configuration: SPST; Operating Force: 3N; Max Current Rating: 50mA; Max Voltage Rating (DC): 32V; Contact Current Rating: 50mA; Length: 3.55mm; Width: 4.6mm; Depth: 4.6mm; Size: 2.8mm; Radiation Hardening: No; REACH SVHC: No SVHC; Lead Free: Lead Free; RoHS Compliant: Yes; ComponentLink1URL: https://datasheet.ciiva.com/7986/1754071-7986966.pdf?src-supplier=Element14; ComponentLink1Description: https://datasheet.ciiva.com/7986/1754071-7986966.pdf?src-supplier=Element14; ComponentLink2URL: https://datasheet.ciiva.com/16388/kms231glfs-16388616.pdf?src-supplier=Future+Electronics; ComponentLink2Description: https://datasheet.ciiva.com/16388/kms231glfs-16388616.pdf?src-supplier=Future+Electronics; ComponentLink3URL: https://datasheet.ciiva.com/8168/kms-8168505.pdf?src-supplier=Avnet; ComponentLink3Description: https://datasheet.ciiva.com/8168/kms-8168505.pdf?src-supplier=Avnet; ComponentLink4URL: https://datasheet.ciiva.com/2901/kms-2901787.pdf?src-supplier=Digi-Key; ComponentLink4Description: https://datasheet.ciiva.com/2901/kms-2901787.pdf?src-supplier=Digi-Key; ComponentLink5URL: https://datasheet.ciiva.com/2901/kms-2901788.pdf?src-supplier=Digi-Key; ComponentLink5Description: https://datasheet.ciiva.com/2901/kms-2901788.pdf?src-supplier=Digi-Key; ComponentLink6URL: https://datasheet.ciiva.com/2901/kms-2901789.pdf?src-supplier=Digi-Key; ComponentLink6Description: https://datasheet.ciiva.com/2901/kms-2901789.pdf?src-supplier=Digi-Key; ComponentLink7URL: https://datasheet.ciiva.com/5283/kms-13aug12-34537-5283597.pdf?src-supplier=Mouser; ComponentLink7Description: https://datasheet.ciiva.com/5283/kms-13aug12-34537-5283597.pdf?src-supplier=Mouser; ComponentLink8URL: https://datasheet.ciiva.com/5684/1754071-5684445.pdf?src-supplier=Farnell; ComponentLink8Description: https://datasheet.ciiva.com/5684/1754071-5684445.pdf?src-supplier=Farnell
U6 = SP0505BAJTG: ESD Suppressors Five CH Space Saving ESD Protect Device; Manufacturer: Texas Instruments; Capacitance: 8.4pF; Operating Supply Voltage: 5.5V; Direction: Unidirectional; Number of Unidirectional Channels: 5; Number of Bidirectional Channels: 4; Reverse Standoff Voltage: 5V; Min Breakdown Voltage: 6V; Clamping Voltage: 15.6V; Peak Pulse Power: 40W; Power Line Protection: No; Peak Pulse Current: 10A; Diode Type: ZENER; Supplier 1: Digi-Key; Supplier Part Number 1: 296-43577-1-ND; Manufacturer Part Number: TPD5E003DPFR; RoHS: Yes; Category: Integrated Circuits (ICs); Stock 1: 1694; Pricing 1: 1=0,65000, 10=0,56000, 100=0,41850, 500=0,32882, 1000=0,25408, 2000=0,24675 (USD); Mount: Surface Mount; Number of Pins: 6; Min Operating Temperature: -40°C; Max Operating Temperature: 125°C; Package Quantity: 5000; Packaging: Tape and Reel; Breakdown Voltage: 6V; Number of Channels: 5; Termination: SMD/SMT; Polarity: Unidirectional; Working Voltage: 5V; Max Power Dissipation: 40W; Resistor Type: Zener; Series: -; Lead Free: Lead Free; RoHS Compliant: Yes; ComponentLink1URL: https://datasheet.ciiva.com/6577/tpd5e003-6577651.pdf?src-supplier=Digi-Key; ComponentLink1Description: https://datasheet.ciiva.com/6577/tpd5e003-6577651.pdf?src-supplier=Digi-Key
U9 = W25Q128JVPIQ: NOR Flash Serial (SPI, Dual SPI, Quad SPI) 3V/3.3V 128M-bit 16M x 8 6ns 8-Pin WSON EP T/R/Tray/Tube; Manufacturer: Winbond; Memory Type: Non-Volatile,FLASH; Frequency: 133MHz; Memory Size: 128Mb; Supplier 1: Digi-Key; Supplier Part Number 1: W25Q128JVPIQ-ND; Manufacturer Part Number: W25Q128JVPIQ; RoHS: Yes; Category: Flash; Stock 1: 2886; Pricing 1: 1=1,97000, 10=1,79800, 25=1,74960, 50=1,74080, 100=1,55600, 250=1,55152, 500=1,52810, 1000=1,46322, 5000=1,36231 (USD); Mount: Surface Mount; Min Operating Temperature: -40°C; Max Operating Temperature: 85°C; Packaging: Rail/Tube; RoHS Compliant: Yes; ComponentLink1URL: http://www.winbond.com/resource-files/w25q128jv%20revf%2003272018%20plus.pdf?src-supplier=Digi-Key; ComponentLink1Description: http://www.winbond.com/resource-files/w25q128jv%20revf%2003272018%20plus.pdf?src-supplier=Digi-Key
U15 = nRF5340-QKAA: Multi-protocol Bluetooth Low Energy, IEEE 802.15.4, ANT and 2.4GHz proprietary system-on-chip; Pad Count: 98; Part Number: nRF5340-QKAA; Footprint Doc: AQFN-98; Value: nRF5340-QKAA; Component Class: nRF_Devices
X1 = XTAL_SMD2016_32MHz_8pF_Epson: Crystal 32.7680Khz 6Pf Smd / Tape & Reel (Tr) Rohs Compliant: Yes; Manufacturer: ECS International; Supplier 1: Digi-Key; Supplier Part Number 1: XC2284CT-ND; Manufacturer Part Number: ECS-.327-7-1210-TR; RoHS: Yes; Stock 1: 200; Pricing 1: 1=1,63000, 10=1,56100, 50=1,52460, 100=1,30680, 500=1,27050, 1000=1,07085, 2500=1,01640 (USD)
X2 = XTAL_SMD2016_32MHz_8pF_General: Crystal 32MHz 7pF ±20ppm ±20ppm 4-Pin Ultraminiature CSMD T/R; Manufacturer: ECS International; Manufacturer Part Number: ECS-320-7-48B-JTM-TR5; Pad Count: 4; Part Number: XTAL_SMD2016_32MHz_8pF_General; Value: 32MHz; Footprint Doc: XTAL_2016; Component Class: Oscillators; Supplier 1: Digi-Key; Supplier Part Number 1: 50-ECS-320-7-48B-JTM-TR5CT-ND; RoHS: No; Category: Uncategorized; Stock 1: 4973; Pricing 1: 1=1,25000, 10=1,19500, 50=1,16760, 100=1,00080, 500=0,97300, 1000=0,82010, 2500=0,77840 (USD)